# Altium schematic sheet Bewaesserung_Rev_B.SchDoc: =ProjectTitle
size A3; Organization: Nerdtronix GmbH; Address1: Industriestraße 14a; Address2: D-86438 Kissing; SheetNumber: 1; SheetTotal: 1
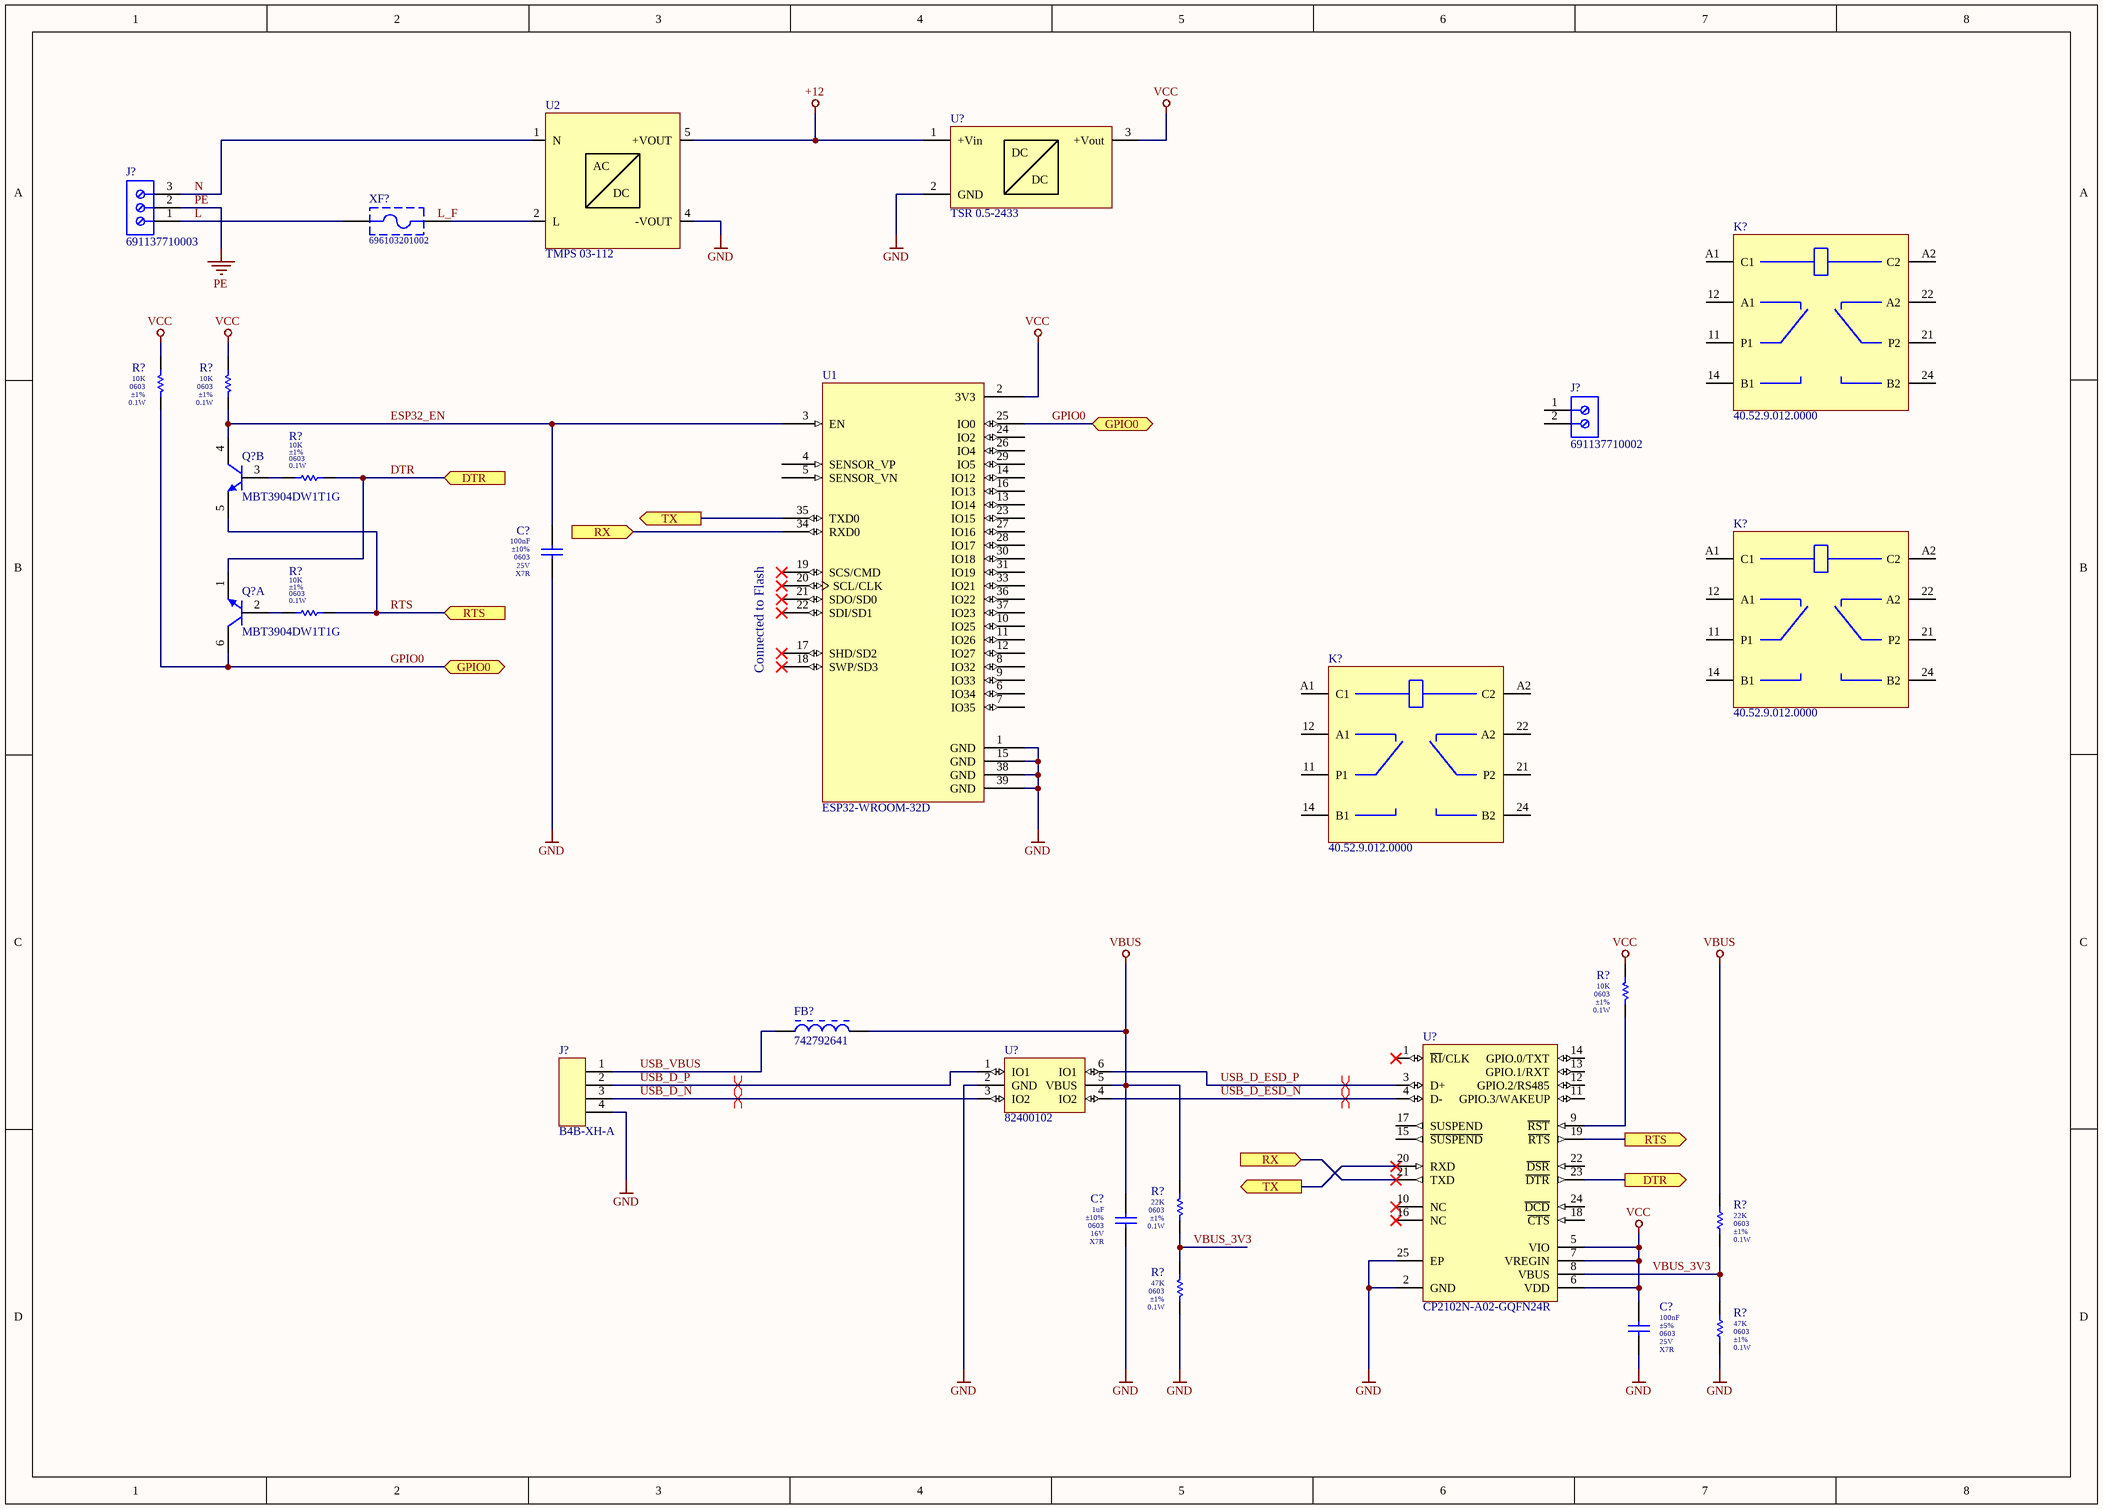
[diagram p0: Bewaesserung_Rev_B.SchDoc]

## Parts
(Parts that share a designator on the sheet are numbered #1, #2 ... from top to bottom, then left to right.)
C?#1  value 100nF  Tolerance: ±10%  Package: 0603  Voltage: 25V  Dielectric: X7R  [C_0603_B]  (hidden comment: CL10B104KA8NNNC)
C?#2  value 1uF  Tolerance: ±10%  Package: 0603  Voltage: 16V  Dielectric: X7R  [C_0603_B]  (hidden comment: CL10B105KO8NNNC)
C?#3  value 100nF  Tolerance: ±5%  Package: 0603  Voltage: 25V  Dielectric: X7R  [C_0603_B]  (hidden comment: CL10B104JA8NNNC)
FB?  742792641  [WE-CBF_0603_High Current]
J?#1  691137710003  [691137710003]
J?#2  691137710002  [691137710002]
J?#3  B4B-XH-A  [JST_XH_2.54_4pin_vert]
K?#1  40.52.9.012.0000  [40.52.9.012.0000]
K?#2  40.52.9.012.0000  [40.52.9.012.0000]
K?#3  40.52.9.012.0000  [40.52.9.012.0000]
Q?#1  MBT3904DW1T1G  [ONSC-SOT-363-6-419B-02_W_V]  (part B of 2)
Q?#2  MBT3904DW1T1G  [ONSC-SOT-363-6-419B-02_W_V]  (part A of 2)
R?#1  value 10K  Package: 0603  Tolerance: ±1%  Power: 0.1W  [R_0603_B]  (hidden comment: RC0603FR-0710KL)
R?#2  value 10K  Package: 0603  Tolerance: ±1%  Power: 0.1W  [R_0603_B]  (hidden comment: RC0603FR-0710KL)
R?#3  value 10K  Package: 0603  Tolerance: ±1%  Power: 0.1W  [R_0603_B]  (hidden comment: RC0603FR-0710KL)
R?#4  value 10K  Package: 0603  Tolerance: ±1%  Power: 0.1W  [R_0603_B]  (hidden comment: RC0603FR-0710KL)
R?#5  value 10K  Package: 0603  Tolerance: ±1%  Power: 0.1W  [R_0603_B]  (hidden comment: RC0603FR-0710KL)
R?#6  value 22K  Package: 0603  Tolerance: ±1%  Power: 0.1W  [R_0603_B]  (hidden comment: RC0603FR-0722KL)
R?#7  value 22K  Package: 0603  Tolerance: ±1%  Power: 0.1W  [R_0603_B]  (hidden comment: RC0603FR-0722KL)
R?#8  value 47K  Package: 0603  Tolerance: ±1%  Power: 0.1W  [R_0603_B]  (hidden comment: RC0603FR-0747KL)
R?#9  value 47K  Package: 0603  Tolerance: ±1%  Power: 0.1W  [R_0603_B]  (hidden comment: RC0603FR-0747KL)
U1  ESP32-WROOM-32D  [MODULE_ESP32-WROOM-32D]
U2  TMPS 03-112  [TMPS 03]
U?#1  TSR 0.5-2433  [TSR 0.5-2433-Footprint-1]
U?#2  CP2102N-A02-GQFN24R  [SLAB-QFN-24-2550x2550TP_A_V]
U?#3  82400102  [SOT95P280X145-6N]
XF?  696103201002  [696103201002]

## Ports
DTR (in), DTR (out), GPIO0 (bidir), RTS (in), RTS (out), RX (in), TX (out)

## Nets
+12: U2.5(+VOUT) U?#1.1(+Vin)
GND: C?#1.1 C?#2.1 C?#3.1 J?#3.4 R?#8.1 R?#9.1 U1.1(GND) U1.15(GND) U1.38(GND) U1.39(GND) U2.4(-VOUT) U?#1.2(GND) U?#2.2(GND) U?#2.25(EP) U?#3.2(GND)
PE: J?#1.2
VBUS: C?#2.2 FB?.2 R?#6.2 R?#7.2 U?#3.5(VBUS)
VCC: C?#3.2 R?#1.2 R?#2.2 R?#5.2 U1.2(3V3) U?#1.3(+Vout) U?#2.5(VIO) U?#2.6(VDD) U?#2.7(VREGIN)
DTR: Q?#2.1(E) R?#3.1 U?#2.23(~{DTR}) ; port DTR
ESP32_EN: C?#1.2 Q?#1.4(C) R?#2.1 U1.3(EN)
GPIO0: Q?#2.6(C) R?#1.1 U1.25(IO0) ; port GPIO0
L: J?#1.1 XF?.1
N: J?#1.3 U2.1(N)
RTS: Q?#1.5(E) R?#4.1 U?#2.19(~{RTS}) ; port RTS
RX: U1.34(RXD0) U?#2.21(TXD) ; port RX
TX: U1.35(TXD0) U?#2.20(RXD) ; port TX
USB_D_ESD_N: U?#2.4(D-) U?#3.4(IO2)
USB_D_ESD_P: U?#2.3(D+) U?#3.6(IO1)
USB_D_N: J?#3.3 U?#3.3(IO2)
USB_D_P: J?#3.2 U?#3.1(IO1)
USB_VBUS: FB?.1 J?#3.1
VBUS_3V3: R?#6.1 R?#7.1 R?#8.2 R?#9.2 U?#2.8(VBUS)
NetQ?#1_3: Q?#1.3(B) R?#3.2
NetQ?#2_2: Q?#2.2(B) R?#4.2
NetR?#5_1: R?#5.1 U?#2.9(~{RST})
NetU2_2: U2.2(L) XF?.2

Not connected (* = marked no-connect by the designer): J?#2 1 2; K?#1 11(P1) 12(A1) 14(B1) 21(P2) 22(A2) 24(B2) A1(C1) A2(C2); K?#2 11(P1) 12(A1) 14(B1) 21(P2) 22(A2) 24(B2) A1(C1) A2(C2); K?#3 11(P1) 12(A1) 14(B1) 21(P2) 22(A2) 24(B2) A1(C1) A2(C2); U1 4(SENSOR_VP) 5(SENSOR_VN) 6(IO34) 7(IO35) 8(IO32) 9(IO33) 10(IO25) 11(IO26) 12(IO27) 13(IO14) 14(IO12) 16(IO13) 17(SHD/SD2)* 18(SWP/SD3)* 19(SCS/CMD)* 20(SCL/CLK)* 21(SDO/SD0)* 22(SDI/SD1)* 23(IO15) 24(IO2) 26(IO4) 27(IO16) 28(IO17) 29(IO5) 30(IO18) 31(IO19) 33(IO21) 36(IO22) 37(IO23); U?#2 1(~{RI}/CLK)* 10(NC)* 11(GPIO.3/WAKEUP) 12(GPIO.2/RS485) 13(GPIO.1/RXT) 14(GPIO.0/TXT) 15(~{SUSPEND}) 16(NC)* 17(SUSPEND) 18(~{CTS}) 22(~{DSR}) 24(~{DCD})

## Layout directives
differential pair; differential pair class USB_D_ESD: USB_D_ESD_N, USB_D_ESD_P
differential pair; differential pair class USB_D: USB_D_N, USB_D_P

## Notes on the sheet
- Connected to Flash
- Labels drawn without touching a wire or pin: L_F
- Title
- Size:
- Date:
- A3
- Number:
- Time:
- Revision:
- Sheet
- of
- Author:
- File:
- (in symbol CMP-002-000000-3) AC; DC
- (in symbol CMP-002-000808-1) DC

## Library data of the parts
C?#1 = CMP-001-00198-18: CAP 100nF 25V 0603 ±10% X7R; Manufacturer: Samsung; Placed: Yes; Revision Status: new; Pad Count: 2; Creator: Mst 10-08-21; Mounting Type: SMD; Distributor Ordering Code: 1276-1006-1-ND; Maximum Operating Temperature: 125; Manufacturer Part Number: CL10B104KA8NNNC; Packaging: cut tape; Minimum Operating Temperature: -55; RoHS: yes; Distributor: Digikey
C?#2 = CMP-001-00192-18: CAP 1uF 16V 0603 ±10% X7R; Manufacturer: Samsung; Pad Count: 2; Placed: Yes; Revision Status: new; Creator: Mst 10-08-21; Distributor Ordering Code: 1276-1019-1-ND; Manufacturer Part Number: CL10B105KO8NNNC; Minimum Operating Temperature: -55; RoHS: yes; Mounting Type: SMD; Maximum Operating Temperature: 125; Packaging: cut tape; Distributor: Digikey
C?#3 = CMP-001-00197-18: CAP 100nF 25V 0603 ±5% X7R; Manufacturer: Samsung; Revision Status: new; Placed: Yes; Pad Count: 2; Creator: Mst 10-08-21; Manufacturer Part Number: CL10B104JA8NNNC; Maximum Operating Temperature: 125; Distributor: Digikey; RoHS: yes; Minimum Operating Temperature: -55; Mounting Type: SMD; Distributor Ordering Code: 1276-1929-1-ND; Packaging: cut tape
FB? = CMP-002-000813-2: WE-CBF SMT EMI Suppression Ferrite Bead, size 0603, 300Ohm, 2A; Manufacturer: Wuerth Elektronik; Revision Status: new; Pad Count: 2; Placed: yes; DCR_max: 0.15Ohm; Creator: MSt 08-12-21; Minimum Operating Temperature: -55; Packaging: cut tape; Maximum Operating Temperature: 125; I_max: 2A; Manufacturer Part Number: 742792641; Mounting Type: SMD; RoHS: yes; Z@100MHz: 300Ohm; Distributor Ordering Code: 732-1592-1-ND; Distributor: Digikey
J?#1 = CMP-003-000003-2: WR-TBL Serie 1377 Horizontal Entry, Pressure Clamp, THT, pitch 5mm, 3p; Manufacturer: Wuerth Elektronik; Revision Status: yes; Pad Count: 3; Mounting Type: THT; Packaging: bag; Minimum Operating Temperature: -30; Creator: MSt 08-12-21; Distributor Ordering Code: 732-10956-ND; Distributor: Digikey; Manufacturer Part Number: 691137710003; RoHS: yes; Maximum Operating Temperature: 110; Placed: yes
J?#2 = CMP-003-000002-2: WR-TBL Serie 1377 Horizontal Entry, Pressure Clamp, THT, pitch 5mm, 2p; Manufacturer: Wuerth Elektronik; Placed: yes; Pad Count: 2; Revision Status: new; Maximum Operating Temperature: 110; Distributor Ordering Code: 732-10955-ND; Creator: MSt 08-12-21; Mounting Type: THT; Minimum Operating Temperature: -30; Packaging: bag; Manufacturer Part Number: 691137710002; RoHS: yes; Distributor: Digikey
J?#3 = CMP-002-000812-2: JST XH-series, vertical, THT, 4-pol.; Manufacturer Part Number: B4B-XH-A(LF)(SN); Revision Status: new; Pad Count: 4; Placed: yes; Distributor Ordering Code: 455-2249-ND; Creator: MSt 29-11-21; Design Item ID: B4B-XH-A; Maximum Operating Temperature: 85; Distributor: Digikey; RoHS: yes; Source: jst.SchLib; Manufacturer: JST; Mounting Type: THT; Packaging: bag; Minimum Operating Temperature: -25
K?#1-K?#3 = CMP-002-000814-3: relay double pole, 12V coil voltage, 8 A continous switched current; Manufacturer: Finder Relays, Inc.; coil_resistance: 220Ohm; coil_voltage_min: 8.8V; coil_voltage_max: 18.0V; Revision Status: new; Placed: yes; Pad Count: 8; coil_current: 55mA; Distributor Ordering Code: 2066-40.52.9.012.0000-ND; Distributor: Digikey; Mounting Type: THT; Maximum Operating Temperature: 85; Minimum Operating Temperature: -40; Packaging: bag; Manufacturer Part Number: 40.52.9.012.0000; RoHS: yes; Creator: MSt 08-12-21
Q?#1 Q?#2 = CMP-013-00000-3: Dual General Purpose NPN Transistors; Manufacturer: Central Semiconductor Corp; Pad Count: 6; Revision Status: new; Placed: yes; Distributor: Digikey; RoHS: yes; Minimum Operating Temperature: -65; Maximum Operating Temperature: 150; Packaging: cut tape; Manufacturer Part Number: CMKT3920 TR PBFREE; Distributor Ordering Code: 1514-CMKT3920TRPBFREECT-ND; Mounting Type: SMD; Creator: MSt 28-11-21
R?#1-R?#5 = CMP-002-004901-28: RES 10K 0603 1% 0.1W; Manufacturer: Yageo; Maximum Voltage: 150V; Pad Count: 2; Placed: Yes; Revision Status: new; Mounting Type: SMD; Packaging: cut tape; Distributor: Digikey; Creator: MSt 26-08-21; Minimum Operating Temperature: -55; Manufacturer Part Number: RC0603FR-0710KL; RoHS: yes; Maximum Operating Temperature: 155; Distributor Ordering Code: 311-10.0KHRCT-ND
R?#6 R?#7 = CMP-002-000339-3: RES 22K 0603 1% 0.1W; Manufacturer: Yageo; Revision Status: new; Maximum Voltage: 150V; Pad Count: 2; Manufacturer Part Number: RC0603FR-0722KL; Distributor Ordering Code: 311-22.0KHRCT-ND; Creator: MSt 12-11-21; Packaging: cut tape; Minimum Operating Temperature: -55; Distributor: Digikey; RoHS: yes; Maximum Operating Temperature: 155; Mounting Type: SMD
R?#8 R?#9 = CMP-002-000347-3: RES 47K 0603 1% 0.1W; Manufacturer: Yageo; Maximum Voltage: 150V; Pad Count: 2; Revision Status: new; Packaging: cut tape; Maximum Operating Temperature: 155; Distributor: Digikey; RoHS: yes; Mounting Type: SMD; Manufacturer Part Number: RC0603FR-0747KL; Distributor Ordering Code: 311-47.0KHRCT-ND; Minimum Operating Temperature: -55; Creator: MSt 12-11-21
U1 = CMP-013-000000-3: ESP32-WROOM-32D (16MB); Manufacturer: Espressif Systems; Pad Count: 39; Revision Status: new; Placed: Yes; Creator: MSt 05-10-21; Mounting Type: SMD; Packaging: cut tape; Minimum Operating Temperature: -40; Maximum Operating Temperature: 85; RoHS: yes; Distributor Ordering Code: 1904-1025-1-ND; Manufacturer Part Number: ESP32-WROOM-32D (16MB); Distributor: Digikey
U2 = CMP-002-000000-3: Traco 3W AC/DC converter; 12V output; Manufacturer: Traco Power; Revision Status: new; Pad Count: 5; Placed: Yes; Creator: MSt 05-10-21; Maximum Operating Temperature: 70; Manufacturer Part Number: TMPS 03-112; Mounting Type: THT; Minimum Operating Temperature: -25; RoHS: yes; Packaging: box; Distributor Ordering Code: 1951-1176-ND; Distributor: Digikey
U?#1 = CMP-002-000808-1: Traco 0.5A DC/DC converter; 3.3V output; Revision Status: new; Placed: yes; Pad Count: 3; Packaging: bulk; RoHS: yes; Manufacturer Part Number: TSR 0.5-2433; Creator: MSt 15-11-21; Minimum Operating Temperature: -40; Manufacturer: Traco; Distributor: Digikey; Maximum Operating Temperature: 90; Distributor Ordering Code: 1951-2707-ND; Mounting Type: THT
U?#2 = CMP-001-0012-2: USB Interface IC USBXpress - USB to UART Bridge; Manufacturer: Silicon Labs; Revision Status: new; Placed: yes; Pad Count: 25; Distributor Ordering Code: 634-CP2102NA02QFN24R; Distributor: Mouser; Packaging: cut tape; Mounting Type: SMD; Creator: MSt 29-11-21; RoHS: yes; Manufacturer Part Number: CP2102N-A02-GQFN24R; Minimum Operating Temperature: -40; Maximum Operating Temperature: 85
U?#3 = CMP-001-0008-2: 82400102, USB ESD protection; Manufacturer: Wuerth Elektronik; Pad Count: 6; Placed: yes; Revision Status: new; Manufacturer Part Number: 82400102; Maximum Operating Temperature: 125; Mounting Type: SMD; RoHS: yes; Creator: MSt 29-11-21; Packaging: cut tape; Minimum Operating Temperature: -55; Distributor Ordering Code: 732-4473-1-ND; Distributor: Digikey
XF? = CMP-003-000004-2: WR-FSH Fuseholder THR Blocks PCB Clip Cover; Manufacturer: Wuerth Elektronik; Placed: yes; Pad Count: 2; Revision Status: new; Distributor: Digikey; Minimum Operating Temperature: -30; Maximum Operating Temperature: 120; Distributor Ordering Code: 732-11372-ND; Creator: MSt 08-12-21; Manufacturer Part Number: 696103201002; Mounting Type: THT; RoHS: yes; Packaging: box